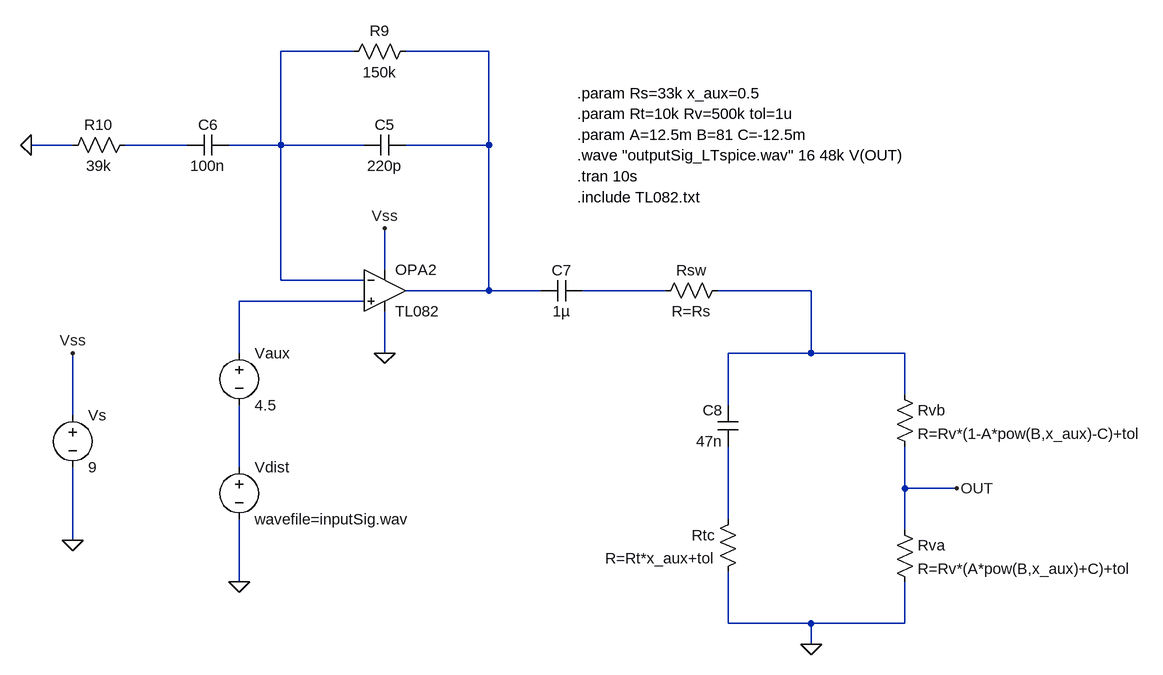
[diagram p0: schematic OCD_ToneControl_Circuit.asc]
OCD_ToneControl_Circuit.asc, the LTspice schematic file:
Version 4
SHEET 1 2324 932
WIRE 944 -80 832 -80
WIRE 1152 -80 1024 -80
WIRE 512 64 448 64
WIRE 688 64 592 64
WIRE 832 64 832 -80
WIRE 832 64 752 64
WIRE 960 64 832 64
WIRE 1152 64 1152 -80
WIRE 1152 64 1024 64
WIRE 992 256 992 192
WIRE 832 272 832 64
WIRE 960 272 832 272
WIRE 1152 288 1152 64
WIRE 1152 288 1024 288
WIRE 1232 288 1152 288
WIRE 1424 288 1296 288
WIRE 1648 288 1504 288
WIRE 960 304 768 304
WIRE 768 384 768 304
WIRE 992 384 992 320
WIRE 1648 384 1648 288
WIRE 1648 384 1520 384
WIRE 1792 384 1648 384
WIRE 1792 448 1792 384
WIRE 1520 464 1520 384
WIRE 512 480 512 384
WIRE 768 560 768 464
WIRE 1792 592 1792 528
WIRE 1872 592 1792 592
WIRE 1520 640 1520 528
WIRE 1792 656 1792 592
WIRE 512 672 512 560
WIRE 768 736 768 640
WIRE 1520 800 1520 720
WIRE 1648 800 1520 800
WIRE 1792 800 1792 736
WIRE 1792 800 1648 800
WIRE 1648 832 1648 800
FLAG 448 64 0
FLAG 1648 832 0
FLAG 1872 592 OUT
FLAG 768 736 0
FLAG 512 672 0
FLAG 512 384 Vss
FLAG 992 192 Vss
FLAG 992 384 0
SYMBOL cap 1024 48 R90
WINDOW 0 0 32 VBottom 2
WINDOW 3 32 32 VTop 2
SYMATTR InstName C5
SYMATTR Value 220p
SYMBOL res 1040 -96 R90
WINDOW 0 0 56 VBottom 2
WINDOW 3 32 56 VTop 2
SYMATTR InstName R9
SYMATTR Value 150k
SYMBOL cap 752 48 R90
WINDOW 0 0 32 VBottom 2
WINDOW 3 32 32 VTop 2
SYMATTR InstName C6
SYMATTR Value 100n
SYMBOL res 608 48 R90
WINDOW 0 0 56 VBottom 2
WINDOW 3 32 56 VTop 2
SYMATTR InstName R10
SYMATTR Value 39k
SYMBOL cap 1296 272 R90
WINDOW 0 0 32 VBottom 2
WINDOW 3 32 32 VTop 2
SYMATTR InstName C7
SYMATTR Value 1µ
SYMBOL res 1520 272 R90
WINDOW 0 0 56 VBottom 2
WINDOW 3 32 56 VTop 2
SYMATTR InstName Rsw
SYMATTR Value R=Rs
SYMBOL cap 1536 464 M0
SYMATTR InstName C8
SYMATTR Value 47n
SYMBOL voltage 768 544 R0
SYMATTR InstName Vdist
SYMATTR Value wavefile=inputSig.wav
SYMBOL res 1536 624 M0
SYMATTR InstName Rtc
SYMATTR Value R=Rt*x_aux+tol
SYMBOL res 1776 432 R0
SYMATTR InstName Rvb
SYMATTR Value R=Rv*(1-A*pow(B,x_aux)-C)+tol
SYMBOL res 1776 640 R0
SYMATTR InstName Rva
SYMATTR Value R=Rv*(A*pow(B,x_aux)+C)+tol
SYMBOL voltage 512 464 R0
SYMATTR InstName Vs
SYMATTR Value 9
SYMBOL OpAmps\\opamp2 992 224 R0
SYMATTR InstName OPA2
SYMATTR Value TL082
SYMBOL voltage 768 368 R0
SYMATTR InstName Vaux
SYMATTR Value 4.5
TEXT 1288 -16 Left 2 !.param Rs=33k x_aux=0.5
TEXT 1288 16 Left 2 !.param Rt=10k Rv=500k tol=1u
TEXT 1288 80 Left 2 !.wave "outputSig_LTspice.wav" 16 48k V(OUT)
TEXT 1288 112 Left 2 !.tran 10s
TEXT 1288 48 Left 2 !.param A=12.5m B=81 C=-12.5m
TEXT 1288 144 Left 2 !.include TL082.txt

The netlist it stands for:
* OCD_ToneControl_Circuit.asc
C5 N002 N001 220p
R9 N002 N001 150k
C6 N001 N003 100n
R10 N003 0 39k
C7 N004 N002 1µ
Rsw N005 N004 R=Rs
C8 N005 N008 47n
Vdist N007 0 wavefile=inputSig.wav
Rtc N008 0 R=Rt*x_aux+tol
Rvb N005 OUT R=Rv*(1-A*pow(B,x_aux)-C)+tol
Rva OUT 0 R=Rv*(A*pow(B,x_aux)+C)+tol
Vs Vss 0 9
XOPA2 N006 N001 Vss 0 N002 TL082  ; pins In+ In- V+ V- OUT
Vaux N006 N007 4.5
.param Rs=33k x_aux=0.5
.param Rt=10k Rv=500k tol=1u
.wave "outputSig_LTspice.wav" 16 48k V(OUT)
.tran 10s
.param A=12.5m B=81 C=-12.5m
.include TL082.txt
.backanno
.end